# EAGLE design PGTNX07_gate_out (EAGLE 8.5.2)
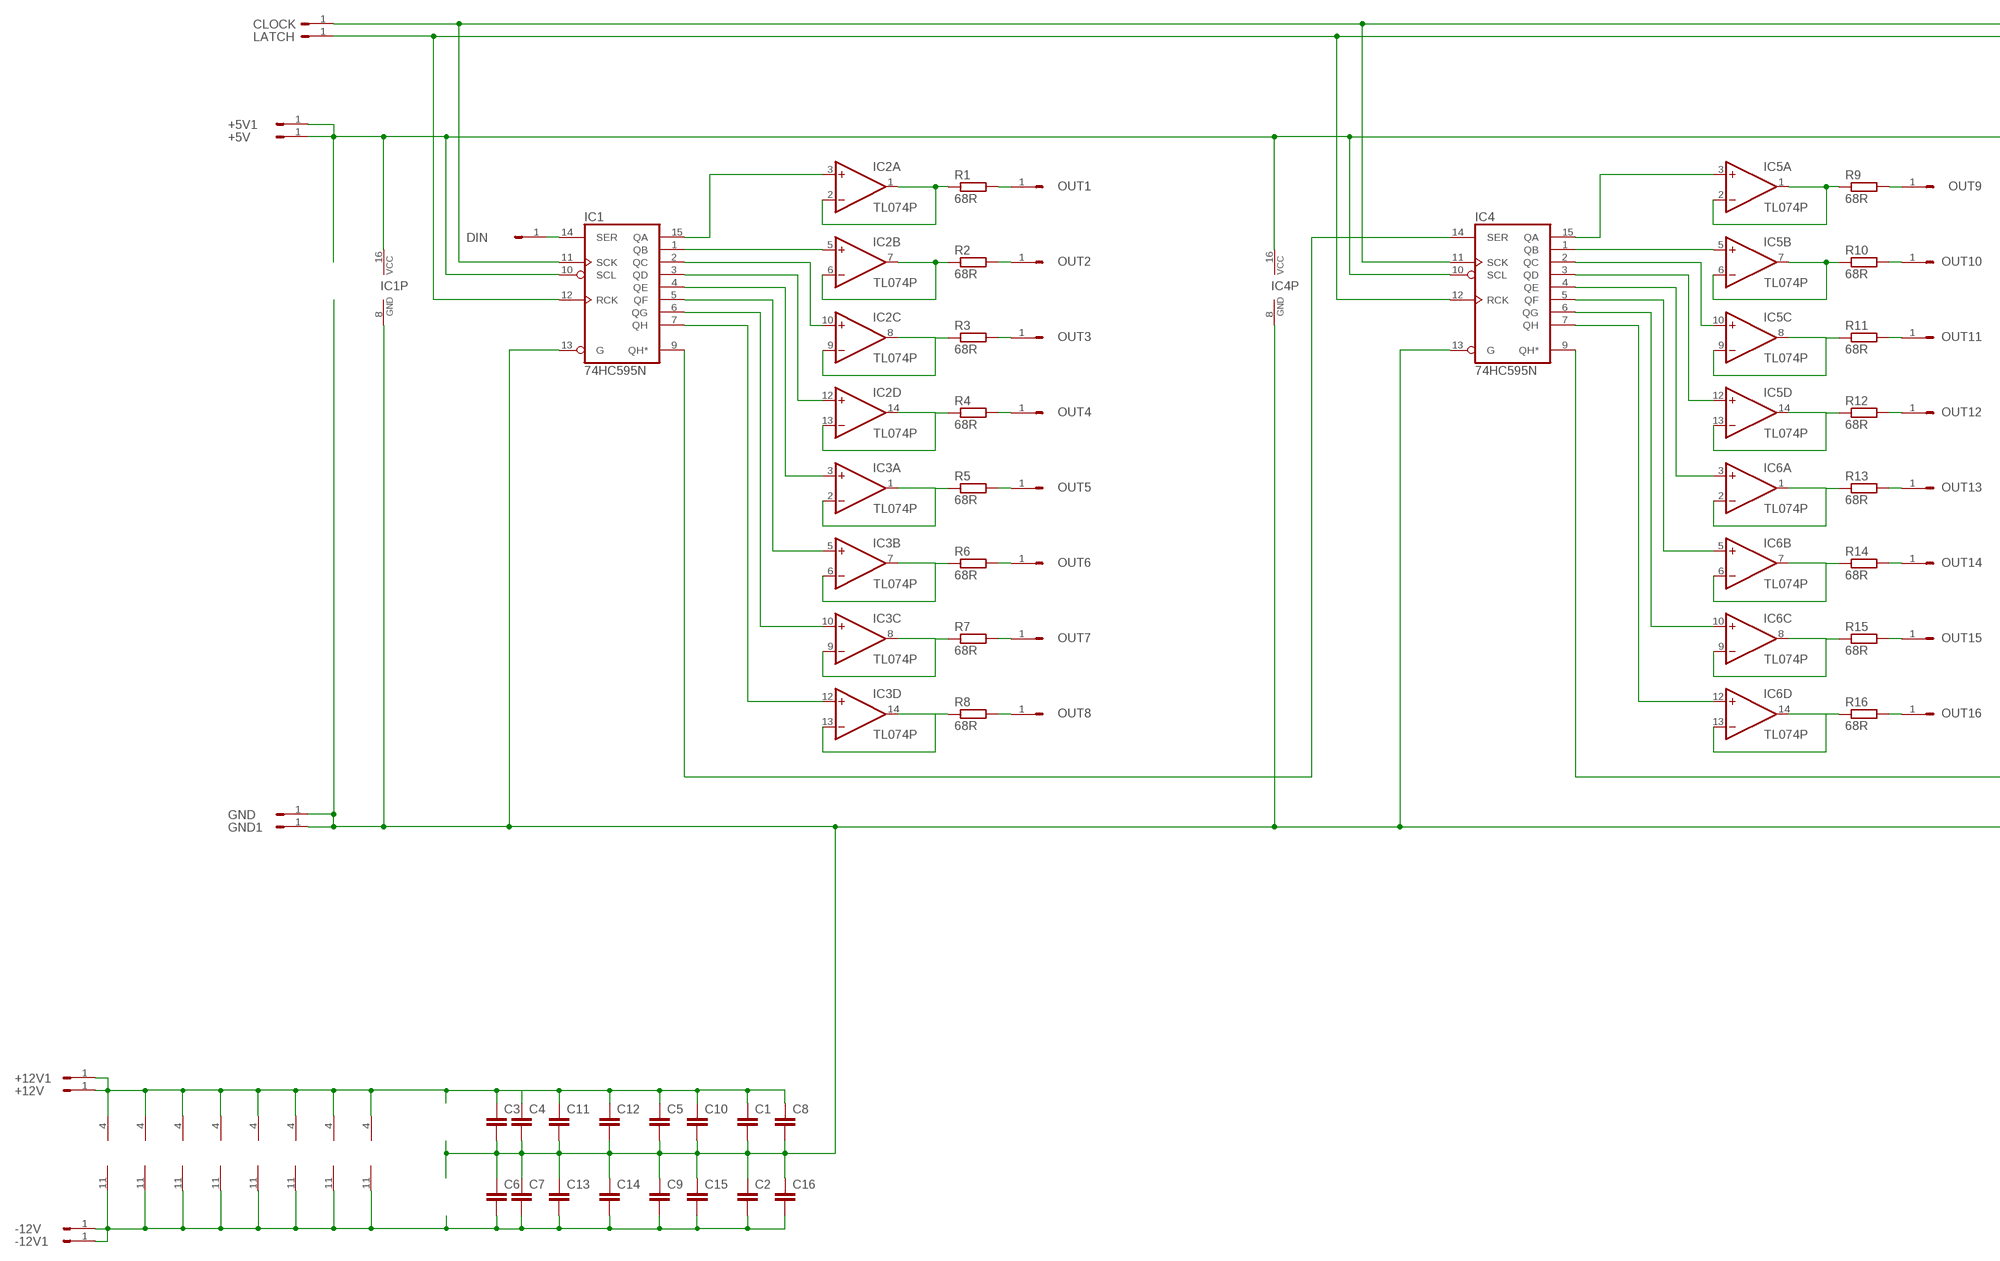
[diagram p0: schematic, sheet 1, part 1 of 2]
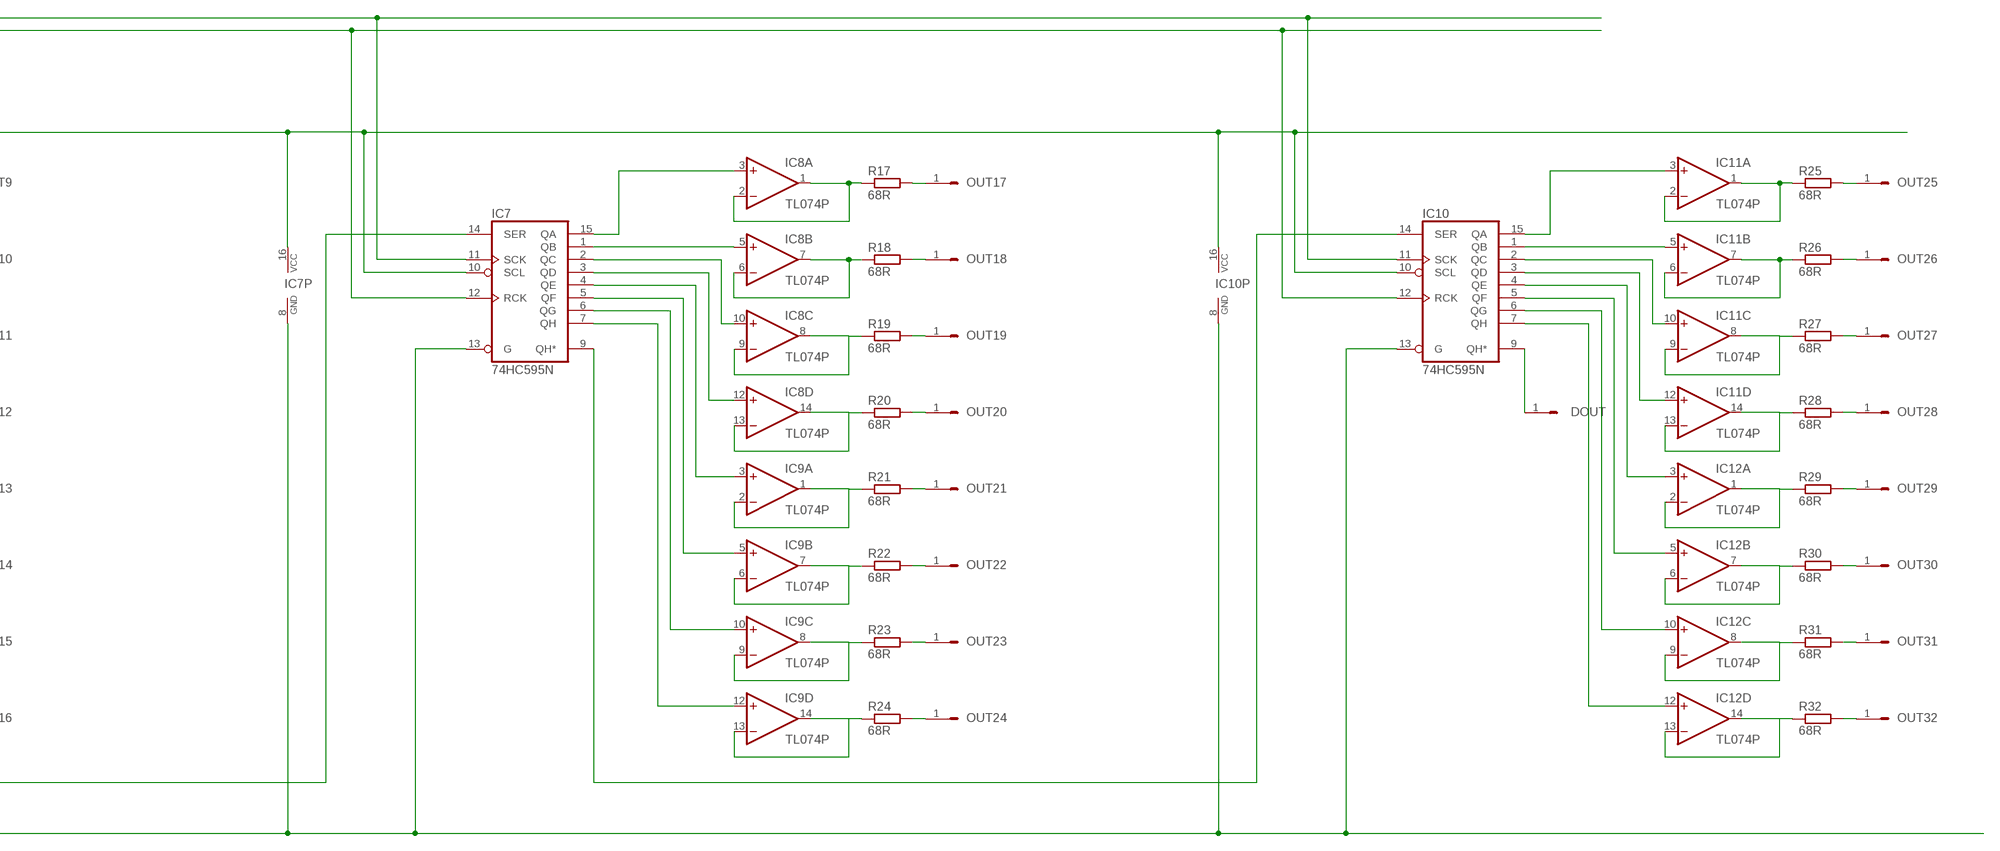
[diagram p1: schematic, sheet 1, part 2 of 2]

## Parts
+5V  HEADER/MALE/01  [HEADER/MALE/01]
+5V1  HEADER/MALE/01  [HEADER/MALE/01]
+12V  HEADER/MALE/01  [HEADER/MALE/01]
+12V1  HEADER/MALE/01  [HEADER/MALE/01]
-12V  HEADER/MALE/01  [HEADER/MALE/01]
-12V1  HEADER/MALE/01  [HEADER/MALE/01]
C1  CAPACITORCERAMICDISC/5  [CERAMICDISC/5]
C2  CAPACITORCERAMICDISC/5  [CERAMICDISC/5]
C3  CAPACITORCERAMICDISC/5  [CERAMICDISC/5]
C4  CAPACITORCERAMICDISC/5  [CERAMICDISC/5]
C5  CAPACITORCERAMICDISC/5  [CERAMICDISC/5]
C6  CAPACITORCERAMICDISC/5  [CERAMICDISC/5]
C7  CAPACITORCERAMICDISC/5  [CERAMICDISC/5]
C8  CAPACITORCERAMICDISC/5  [CERAMICDISC/5]
C9  CAPACITORCERAMICDISC/5  [CERAMICDISC/5]
C10  CAPACITORCERAMICDISC/5  [CERAMICDISC/5]
C11  CAPACITORCERAMICDISC/5  [CERAMICDISC/5]
C12  CAPACITORCERAMICDISC/5  [CERAMICDISC/5]
C13  CAPACITORCERAMICDISC/5  [CERAMICDISC/5]
C14  CAPACITORCERAMICDISC/5  [CERAMICDISC/5]
C15  CAPACITORCERAMICDISC/5  [CERAMICDISC/5]
C16  CAPACITORCERAMICDISC/5  [CERAMICDISC/5]
CLOCK  HEADER/MALE/01  [HEADER/MALE/01]
DIN  HEADER/MALE/01  [HEADER/MALE/01]
DOUT  HEADER/MALE/01  [HEADER/MALE/01]
GND  HEADER/MALE/01  [HEADER/MALE/01]
GND1  HEADER/MALE/01  [HEADER/MALE/01]
IC1  74HC595N  [DIL16]
IC2  TL074P  [DIL14]
IC3  TL074P  [DIL14]
IC4  74HC595N  [DIL16]
IC5  TL074P  [DIL14]
IC6  TL074P  [DIL14]
IC7  74HC595N  [DIL16]
IC8  TL074P  [DIL14]
IC9  TL074P  [DIL14]
IC10  74HC595N  [DIL16]
IC11  TL074P  [DIL14]
IC12  TL074P  [DIL14]
LATCH  HEADER/MALE/01  [HEADER/MALE/01]
OUT1  HEADER/MALE/01  [HEADER/MALE/01]
OUT2  HEADER/MALE/01  [HEADER/MALE/01]
OUT3  HEADER/MALE/01  [HEADER/MALE/01]
OUT4  HEADER/MALE/01  [HEADER/MALE/01]
OUT5  HEADER/MALE/01  [HEADER/MALE/01]
OUT6  HEADER/MALE/01  [HEADER/MALE/01]
OUT7  HEADER/MALE/01  [HEADER/MALE/01]
OUT8  HEADER/MALE/01  [HEADER/MALE/01]
OUT9  HEADER/MALE/01  [HEADER/MALE/01]
OUT10  HEADER/MALE/01  [HEADER/MALE/01]
OUT11  HEADER/MALE/01  [HEADER/MALE/01]
OUT12  HEADER/MALE/01  [HEADER/MALE/01]
OUT13  HEADER/MALE/01  [HEADER/MALE/01]
OUT14  HEADER/MALE/01  [HEADER/MALE/01]
OUT15  HEADER/MALE/01  [HEADER/MALE/01]
OUT16  HEADER/MALE/01  [HEADER/MALE/01]
OUT17  HEADER/MALE/01  [HEADER/MALE/01]
OUT18  HEADER/MALE/01  [HEADER/MALE/01]
OUT19  HEADER/MALE/01  [HEADER/MALE/01]
OUT20  HEADER/MALE/01  [HEADER/MALE/01]
OUT21  HEADER/MALE/01  [HEADER/MALE/01]
OUT22  HEADER/MALE/01  [HEADER/MALE/01]
OUT23  HEADER/MALE/01  [HEADER/MALE/01]
OUT24  HEADER/MALE/01  [HEADER/MALE/01]
OUT25  HEADER/MALE/01  [HEADER/MALE/01]
OUT26  HEADER/MALE/01  [HEADER/MALE/01]
OUT27  HEADER/MALE/01  [HEADER/MALE/01]
OUT28  HEADER/MALE/01  [HEADER/MALE/01]
OUT29  HEADER/MALE/01  [HEADER/MALE/01]
OUT30  HEADER/MALE/01  [HEADER/MALE/01]
OUT31  HEADER/MALE/01  [HEADER/MALE/01]
OUT32  HEADER/MALE/01  [HEADER/MALE/01]
R1  68R  RESISTORRESISTOR/UPRIGHT/7.5  [RESISTOR/7.5]
R2  68R  RESISTORRESISTOR/UPRIGHT/7.5  [RESISTOR/7.5]
R3  68R  RESISTORRESISTOR/UPRIGHT/7.5  [RESISTOR/7.5]
R4  68R  RESISTORRESISTOR/UPRIGHT/7.5  [RESISTOR/7.5]
R5  68R  RESISTORRESISTOR/UPRIGHT/7.5  [RESISTOR/7.5]
R6  68R  RESISTORRESISTOR/UPRIGHT/7.5  [RESISTOR/7.5]
R7  68R  RESISTORRESISTOR/UPRIGHT/7.5  [RESISTOR/7.5]
R8  68R  RESISTORRESISTOR/UPRIGHT/7.5  [RESISTOR/7.5]
R9  68R  RESISTORRESISTOR/UPRIGHT/7.5  [RESISTOR/7.5]
R10  68R  RESISTORRESISTOR/UPRIGHT/7.5  [RESISTOR/7.5]
R11  68R  RESISTORRESISTOR/UPRIGHT/7.5  [RESISTOR/7.5]
R12  68R  RESISTORRESISTOR/UPRIGHT/7.5  [RESISTOR/7.5]
R13  68R  RESISTORRESISTOR/UPRIGHT/7.5  [RESISTOR/7.5]
R14  68R  RESISTORRESISTOR/UPRIGHT/7.5  [RESISTOR/7.5]
R15  68R  RESISTORRESISTOR/UPRIGHT/7.5  [RESISTOR/7.5]
R16  68R  RESISTORRESISTOR/UPRIGHT/7.5  [RESISTOR/7.5]
R17  68R  RESISTORRESISTOR/UPRIGHT/7.5  [RESISTOR/7.5]
R18  68R  RESISTORRESISTOR/UPRIGHT/7.5  [RESISTOR/7.5]
R19  68R  RESISTORRESISTOR/UPRIGHT/7.5  [RESISTOR/7.5]
R20  68R  RESISTORRESISTOR/UPRIGHT/7.5  [RESISTOR/7.5]
R21  68R  RESISTORRESISTOR/UPRIGHT/7.5  [RESISTOR/7.5]
R22  68R  RESISTORRESISTOR/UPRIGHT/7.5  [RESISTOR/7.5]
R23  68R  RESISTORRESISTOR/UPRIGHT/7.5  [RESISTOR/7.5]
R24  68R  RESISTORRESISTOR/UPRIGHT/7.5  [RESISTOR/7.5]
R25  68R  RESISTORRESISTOR/UPRIGHT/7.5  [RESISTOR/7.5]
R26  68R  RESISTORRESISTOR/UPRIGHT/7.5  [RESISTOR/7.5]
R27  68R  RESISTORRESISTOR/UPRIGHT/7.5  [RESISTOR/7.5]
R28  68R  RESISTORRESISTOR/UPRIGHT/7.5  [RESISTOR/7.5]
R29  68R  RESISTORRESISTOR/UPRIGHT/7.5  [RESISTOR/7.5]
R30  68R  RESISTORRESISTOR/UPRIGHT/7.5  [RESISTOR/7.5]
R31  68R  RESISTORRESISTOR/UPRIGHT/7.5  [RESISTOR/7.5]
R32  68R  RESISTORRESISTOR/UPRIGHT/7.5  [RESISTOR/7.5]

## Nets
CLK2: +5V1.1 +5V.1 IC1.10(SCL) IC1.16(VCC) IC4.10(SCL) IC4.16(VCC) IC7.10(SCL) IC7.16(VCC) IC10.10(SCL) IC10.16(VCC)
GND: C1.2 C2.1 C3.2 C4.2 C5.2 C6.1 C7.1 C8.2 C9.1 C10.2 C11.2 C12.2 C13.1 C14.1 C15.1 C16.1 GND1.1 GND.1 IC1.8(GND) IC1.13(G) IC4.8(GND) IC4.13(G) IC7.8(GND) IC7.13(G) IC10.8(GND) IC10.13(G)
N$1: IC1.15(QA) IC2.3(A:+IN)
N$2: IC1.1(QB) IC2.5(B:+IN)
N$4: DIN.1 IC1.14(SER)
N$6: IC1.2(QC) IC2.10(C:+IN)
N$7: IC1.3(QD) IC2.12(D:+IN)
N$8: IC1.4(QE) IC3.3(A:+IN)
N$9: IC1.5(QF) IC3.5(B:+IN)
N$10: IC1.6(QG) IC3.10(C:+IN)
N$11: IC1.7(QH) IC3.12(D:+IN)
N$12: IC1.9(QH*) IC4.14(SER)
N$13: IC2.1(A:OUT) IC2.2(A:-IN) R1.1
N$14: OUT1.1 R1.2
N$15: IC2.6(B:-IN) IC2.7(B:OUT) R2.1
N$16: OUT2.1 R2.2
N$17: +12V1.1 +12V.1 C1.1 C3.1 C4.1 C5.1 C8.1 C10.1 C11.1 C12.1 IC2.4(P:V+) IC3.4(P:V+) IC5.4(P:V+) IC6.4(P:V+) IC8.4(P:V+) IC9.4(P:V+) IC11.4(P:V+) IC12.4(P:V+)
N$18: -12V1.1 -12V.1 C2.2 C6.2 C7.2 C9.2 C13.2 C14.2 C15.2 C16.2 IC2.11(P:V-) IC3.11(P:V-) IC5.11(P:V-) IC6.11(P:V-) IC8.11(P:V-) IC9.11(P:V-) IC11.11(P:V-) IC12.11(P:V-)
N$19: CLOCK.1 IC1.11(SCK) IC4.11(SCK) IC7.11(SCK) IC10.11(SCK)
N$21: IC2.8(C:OUT) IC2.9(C:-IN) R3.1
N$22: IC2.13(D:-IN) IC2.14(D:OUT) R4.1
N$23: IC3.1(A:OUT) IC3.2(A:-IN) R5.1
N$24: IC3.6(B:-IN) IC3.7(B:OUT) R6.1
N$25: IC3.8(C:OUT) IC3.9(C:-IN) R7.1
N$26: IC3.13(D:-IN) IC3.14(D:OUT) R8.1
N$27: OUT3.1 R3.2
N$28: OUT4.1 R4.2
N$29: OUT5.1 R5.2
N$30: OUT6.1 R6.2
N$31: OUT7.1 R7.2
N$32: OUT8.1 R8.2
N$33: IC1.12(RCK) IC4.12(RCK) IC7.12(RCK) IC10.12(RCK) LATCH.1
N$34: IC4.9(QH*) IC7.14(SER)
N$35: IC4.2(QC) IC5.10(C:+IN)
N$36: IC4.3(QD) IC5.12(D:+IN)
N$37: IC4.4(QE) IC6.3(A:+IN)
N$38: IC4.5(QF) IC6.5(B:+IN)
N$39: IC4.6(QG) IC6.10(C:+IN)
N$40: IC4.15(QA) IC5.3(A:+IN)
N$41: IC4.1(QB) IC5.5(B:+IN)
N$42: IC4.7(QH) IC6.12(D:+IN)
N$43: IC5.1(A:OUT) IC5.2(A:-IN) R9.1
N$44: OUT9.1 R9.2
N$45: IC5.6(B:-IN) IC5.7(B:OUT) R10.1
N$46: OUT10.1 R10.2
N$47: IC7.9(QH*) IC10.14(SER)
N$48: IC7.2(QC) IC8.10(C:+IN)
N$49: IC5.8(C:OUT) IC5.9(C:-IN) R11.1
N$50: IC5.13(D:-IN) IC5.14(D:OUT) R12.1
N$51: IC6.1(A:OUT) IC6.2(A:-IN) R13.1
N$52: IC6.6(B:-IN) IC6.7(B:OUT) R14.1
N$53: IC6.8(C:OUT) IC6.9(C:-IN) R15.1
N$54: IC6.13(D:-IN) IC6.14(D:OUT) R16.1
N$55: OUT11.1 R11.2
N$56: OUT12.1 R12.2
N$57: OUT13.1 R13.2
N$58: OUT14.1 R14.2
N$59: OUT15.1 R15.2
N$60: OUT16.1 R16.2
N$61: IC7.3(QD) IC8.12(D:+IN)
N$62: IC7.4(QE) IC9.3(A:+IN)
N$63: IC7.5(QF) IC9.5(B:+IN)
N$64: IC7.6(QG) IC9.10(C:+IN)
N$65: IC7.15(QA) IC8.3(A:+IN)
N$66: IC7.1(QB) IC8.5(B:+IN)
N$67: IC7.7(QH) IC9.12(D:+IN)
N$68: IC8.1(A:OUT) IC8.2(A:-IN) R17.1
N$69: OUT17.1 R17.2
N$70: IC8.6(B:-IN) IC8.7(B:OUT) R18.1
N$71: OUT18.1 R18.2
N$72: IC8.8(C:OUT) IC8.9(C:-IN) R19.1
N$73: IC8.13(D:-IN) IC8.14(D:OUT) R20.1
N$74: IC9.1(A:OUT) IC9.2(A:-IN) R21.1
N$75: IC9.6(B:-IN) IC9.7(B:OUT) R22.1
N$76: IC9.8(C:OUT) IC9.9(C:-IN) R23.1
N$77: IC9.13(D:-IN) IC9.14(D:OUT) R24.1
N$78: OUT19.1 R19.2
N$79: OUT20.1 R20.2
N$80: OUT21.1 R21.2
N$81: OUT22.1 R22.2
N$82: OUT23.1 R23.2
N$83: OUT24.1 R24.2
N$84: DOUT.1 IC10.9(QH*)
N$85: IC10.2(QC) IC11.10(C:+IN)
N$86: IC10.3(QD) IC11.12(D:+IN)
N$87: IC10.4(QE) IC12.3(A:+IN)
N$88: IC10.5(QF) IC12.5(B:+IN)
N$89: IC10.6(QG) IC12.10(C:+IN)
N$90: IC10.15(QA) IC11.3(A:+IN)
N$91: IC10.1(QB) IC11.5(B:+IN)
N$92: IC10.7(QH) IC12.12(D:+IN)
N$93: IC11.1(A:OUT) IC11.2(A:-IN) R25.1
N$94: OUT25.1 R25.2
N$95: IC11.6(B:-IN) IC11.7(B:OUT) R26.1
N$96: OUT26.1 R26.2
N$97: IC11.8(C:OUT) IC11.9(C:-IN) R27.1
N$98: IC11.13(D:-IN) IC11.14(D:OUT) R28.1
N$99: IC12.1(A:OUT) IC12.2(A:-IN) R29.1
N$100: IC12.6(B:-IN) IC12.7(B:OUT) R30.1
N$101: IC12.8(C:OUT) IC12.9(C:-IN) R31.1
N$102: IC12.13(D:-IN) IC12.14(D:OUT) R32.1
N$103: OUT27.1 R27.2
N$104: OUT28.1 R28.2
N$105: OUT29.1 R29.2
N$106: OUT30.1 R30.2
N$107: OUT31.1 R31.2
N$108: OUT32.1 R32.2

## Library data of the parts
+5V +5V1 +12V +12V1 -12V -12V1 CLOCK DIN DOUT GND GND1 LATCH OUT1-OUT32 = connectors:HEADER/MALE/01
C1-C16 = capacitors:CAPACITOR: CAPACITOR, European symbol
IC1 IC4 IC7 IC10 = ic_digital:74*595: 8-bit SHIFT REGISTER, output latch
IC2 IC3 IC5 IC6 IC8 IC9 IC11 IC12 = ic_analogue:TL074: OP AMP
R1-R32 = resistors:RESISTOR: RESISTOR, European symbol

## Board
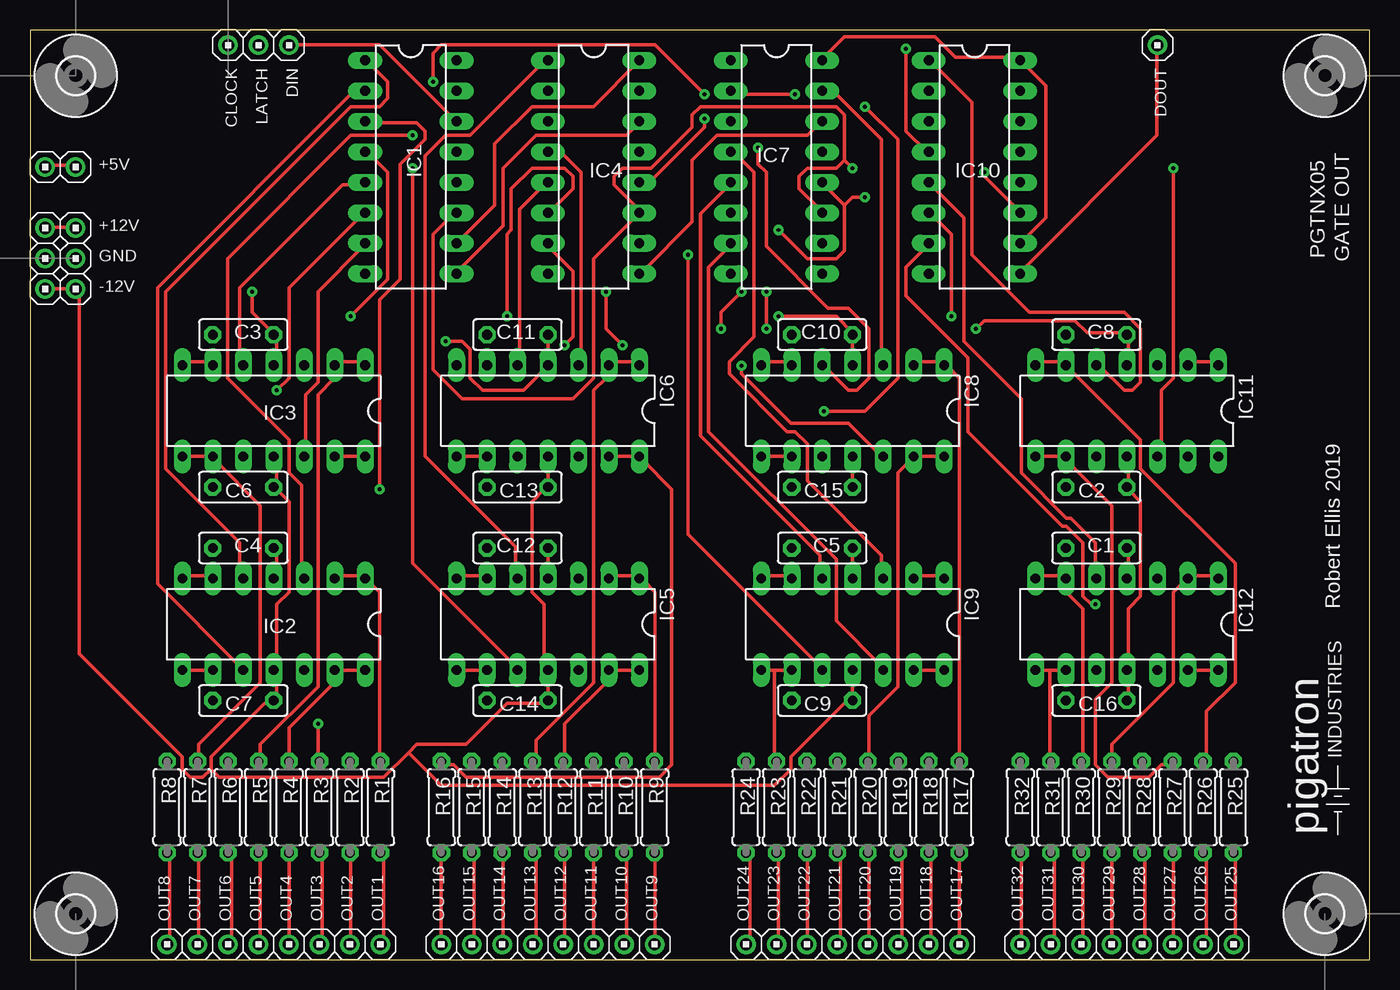
[diagram p2: board, top side]
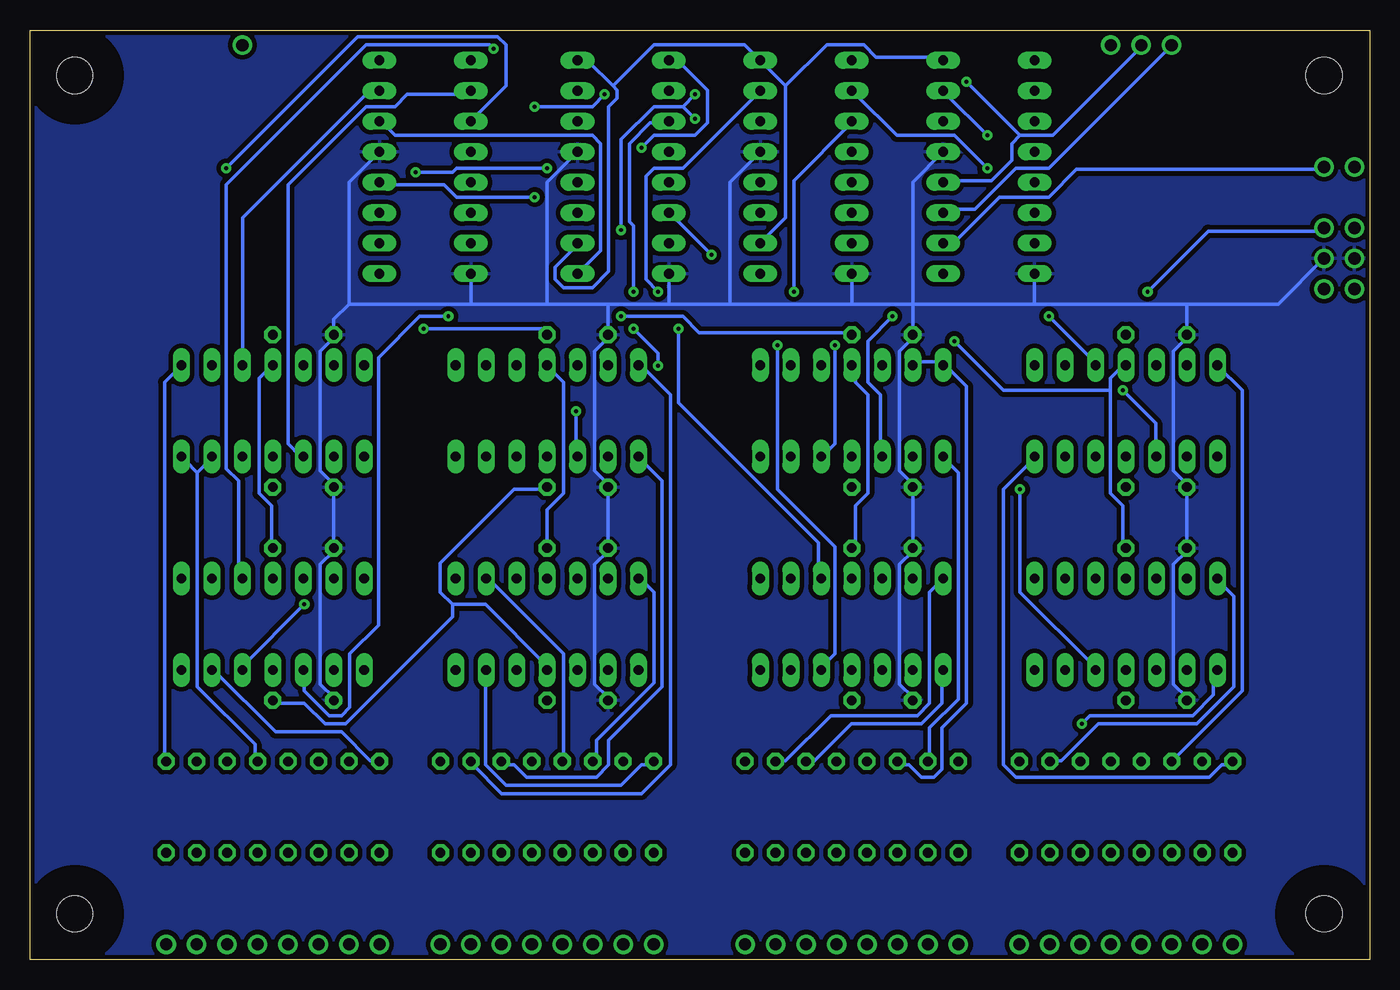
[diagram p3: board, bottom side, seen from below]

Size 111.68 x 77.46 mm. Coordinates in mm from the lower left corner, seen from the top.
Outline: 0,0 111.68,0 111.68,77.46 0,77.46 0,0
Copper layers (1*16): Top 0.0356mm / dielectric 1.5011mm / Bottom 0.0356mm
Design rules "pigatron": minimum track width 12mil, minimum drill 13mil, track to track 15mil, track to pad 10mil, pad to pad 10mil, via to via 10mil, smd to smd 6mil, copper to edge 15mil, drill to drill 10mil, minimum pad ring 12mil, minimum via ring 10mil, stop-mask expansion 4mil, vias tented up to drill 0mil, thermal gap 10mil

### Footprints (pad centres in the part's own frame; a part is rotated, then mirrored left to right if it is on the bottom)
HEADER/MALE/01 = drill 1.016: 1 0,0
CERAMICDISC/5 = drill 0.813 octagon: 1 -2.54,0; 2 2.54,0
DIL16 = drill 0.813 long: 1 -8.89,-3.81; 2 -6.35,-3.81; 3 -3.81,-3.81; 4 -1.27,-3.81; 5 1.27,-3.81; 6 3.81,-3.81; 7 6.35,-3.81; 8 8.89,-3.81; 9 8.89,3.81; 10 6.35,3.81; 11 3.81,3.81; 12 1.27,3.81; 13 -1.27,3.81; 14 -3.81,3.81; 15 -6.35,3.81; 16 -8.89,3.81
DIL14 = drill 0.813 long: 1 -7.62,-3.81; 2 -5.08,-3.81; 3 -2.54,-3.81; 4 0,-3.81; 5 2.54,-3.81; 6 5.08,-3.81; 7 7.62,-3.81; 8 7.62,3.81; 9 5.08,3.81; 10 2.54,3.81; 11 0,3.81; 12 -2.54,3.81; 13 -5.08,3.81; 14 -7.62,3.81
RESISTOR/7.5 = drill 0.813 octagon: 1 -3.81,0; 2 3.81,0
STANDOFF/3.0 = hole 3: 0,0

### Placement (x,y rotation side)
+5V  3.81,66.04 0 top
+5V1  1.27,66.04 0 top
+12V  3.81,60.96 0 top
+12V1  1.27,60.96 0 top
-12V  3.81,55.88 0 top
-12V1  1.27,55.88 0 top
C1  88.9,34.29 180 top
C2  88.9,39.37 0 top
C3  17.78,52.07 180 top
C4  17.78,34.29 180 top
C5  66.04,34.29 180 top
C6  17.78,39.37 0 top
C7  17.78,21.59 0 top
C8  88.9,52.07 180 top
C9  66.04,21.59 0 top
C10  66.04,52.07 180 top
C11  40.64,52.07 180 top
C12  40.64,34.29 180 top
C13  40.64,39.37 0 top
C14  40.64,21.59 0 top
C15  66.04,39.37 0 top
C16  88.9,21.59 0 top
CLOCK  16.51,76.2 270 top
DIN  21.59,76.2 270 top
DOUT  93.98,76.2 270 top
GND  3.81,58.42 0 top
GND1  1.27,58.42 0 top
IC1  31.75,66.04 270 top
IC2  20.32,27.94 180 top
IC3  20.32,45.72 180 top
IC4  46.99,66.04 270 top
IC5  43.18,27.94 180 top
IC6  43.18,45.72 180 top
IC7  62.23,66.04 270 top
IC8  68.58,45.72 180 top
IC9  68.58,27.94 180 top
IC10  78.74,66.04 270 top
IC11  91.44,45.72 180 top
IC12  91.44,27.94 180 top
LATCH  19.05,76.2 270 top
OUT1  29.21,1.27 90 top
OUT2  26.67,1.27 90 top
OUT3  24.13,1.27 90 top
OUT4  21.59,1.27 90 top
OUT5  19.05,1.27 90 top
OUT6  16.51,1.27 90 top
OUT7  13.97,1.27 90 top
OUT8  11.43,1.27 90 top
OUT9  52.07,1.27 90 top
OUT10  49.53,1.27 90 top
OUT11  46.99,1.27 90 top
OUT12  44.45,1.27 90 top
OUT13  41.91,1.27 90 top
OUT14  39.37,1.27 90 top
OUT15  36.83,1.27 90 top
OUT16  34.29,1.27 90 top
OUT17  77.47,1.27 90 top
OUT18  74.93,1.27 90 top
OUT19  72.39,1.27 90 top
OUT20  69.85,1.27 90 top
OUT21  67.31,1.27 90 top
OUT22  64.77,1.27 90 top
OUT23  62.23,1.27 90 top
OUT24  59.69,1.27 90 top
OUT25  100.33,1.27 90 top
OUT26  97.79,1.27 90 top
OUT27  95.25,1.27 90 top
OUT28  92.71,1.27 90 top
OUT29  90.17,1.27 90 top
OUT30  87.63,1.27 90 top
OUT31  85.09,1.27 90 top
OUT32  82.55,1.27 90 top
R1  29.21,12.7 270 top
R2  26.67,12.7 270 top
R3  24.13,12.7 270 top
R4  21.59,12.7 270 top
R5  19.05,12.7 270 top
R6  16.51,12.7 270 top
R7  13.97,12.7 270 top
R8  11.43,12.7 270 top
R9  52.07,12.7 270 top
R10  49.53,12.7 270 top
R11  46.99,12.7 270 top
R12  44.45,12.7 270 top
R13  41.91,12.7 270 top
R14  39.37,12.7 270 top
R15  36.83,12.7 270 top
R16  34.29,12.7 270 top
R17  77.47,12.7 270 top
R18  74.93,12.7 270 top
R19  72.39,12.7 270 top
R20  69.85,12.7 270 top
R21  67.31,12.7 270 top
R22  64.77,12.7 270 top
R23  62.23,12.7 270 top
R24  59.69,12.7 270 top
R25  100.33,12.7 270 top
R26  97.79,12.7 270 top
R27  95.25,12.7 270 top
R28  92.71,12.7 270 top
R29  90.17,12.7 270 top
R30  87.63,12.7 270 top
R31  85.09,12.7 270 top
R32  82.55,12.7 270 top
U$1  [STANDOFF/3.0]  107.95,73.66 0 top
U$2  [STANDOFF/3.0]  107.95,3.81 0 top
U$3  [STANDOFF/3.0]  3.81,73.66 0 top
U$4  [STANDOFF/3.0]  3.81,3.81 0 top
U$5  [PIGATRON-LOGO]  107.44,19.3 90 top

### Tracks (layer width: path | path; a pad name or v marks a point on that pad's centre or on a via)
CLK2
  Top 0.305: IC10.10 82.64,59.77 84.7,61.82 84.7,72.8 82.64,74.85 IC10.16 82.3,75.2 77.15,75.2 75.44,76.91 67.89,76.91 66.18,75.2 IC7.16 | +5V1.1 1.37,66.18 3.77,66.18 +5V.1 | IC1.10 35.66,59.77 38.75,62.85 38.75,68 41.83,71.08 46.98,71.08 50.75,74.85 IC4.16
  Bottom 0.305: 63.09,72.8 65.15,74.85 65.84,74.85 IC7.16 | 63.09,72.8 62.75,72.45 62.75,71.77 63.44,71.08 63.44,57.37 64.81,55.99 67.21,55.99 67.89,56.68 67.89,57.71 66.18,59.42 IC7.10 | 48.69,72.8 48.69,61.82 50.75,59.77 IC4.10 | 48.69,72.8 50.75,74.85 IC4.16 51.09,75.2 52.12,76.23 59.66,76.23 63.09,72.8 | 48.69,72.8 45.26,76.23 42.18,76.23 41.15,75.2 35.66,75.2 IC1.16 | +5V.1 4.12,65.84 24.45,65.84 26.75,63.54 30.86,63.54 34.63,59.77 35.32,59.77 IC1.10
GND
  Top 0.305: 1.37,58.64 GND1.1 | 3.77,58.64 GND.1
  Bottom 0.305: GND.1 7.62,54.61 15.24,54.61 | 15.24,54.61 27.94,54.61 | 27.94,54.61 38.1,54.61 | 38.1,54.61 43.18,54.61 | 43.18,54.61 53.34,54.61 | 53.34,54.61 58.42,54.61 | 58.42,54.61 63.5,54.61 | 63.5,54.61 68.58,54.61 | 68.58,54.61 74.93,54.61 | 74.93,54.61 85.09,54.61 | 85.09,54.61 86.36,53.34 C8.2 86.36,51.82 87.48,50.7 87.48,40.74 86.36,39.62 C2.1 C1.2 86.36,34.04 87.48,32.92 87.48,22.96 86.36,21.84 C16.1 | 15.24,54.61 C3.2 15.24,51.82 16.36,50.7 16.36,40.74 15.24,39.62 C6.1 C4.2 15.24,34.04 16.36,32.92 16.36,22.96 15.24,21.84 C7.1 | 38.1,54.61 C11.2 38.1,51.82 39.22,50.7 39.22,40.74 38.1,39.62 C13.1 C12.2 38.1,34.04 39.22,32.92 39.22,22.96 38.1,21.84 C14.1 | 63.5,54.61 C10.2 63.5,51.82 64.62,50.7 64.62,40.74 63.5,39.62 C15.1 C5.2 63.5,34.04 64.62,32.92 64.62,22.96 63.5,21.84 C9.1 | IC1.8 27.94,54.61 | IC4.8 43.18,54.61 | IC7.8 58.42,54.61 | IC10.8 74.93,54.61 | IC1.13 38.1,64.77 38.1,54.61 | IC4.13 53.34,64.77 53.34,54.61 | IC7.13 68.58,64.77 68.58,54.61 | IC10.13 85.09,64.77 85.09,54.61
  pour Bottom: 0,77.47 0,0 111.76,0 111.76,77.47
N$1  (via drill 0.33)
  Top 0.305: v31.89,68.68 26.75,68.68 16.46,58.39 16.46,48.45 21.6,43.31 21.6,40.56 22.63,39.53 22.63,31.99 IC2.3
  Bottom 0.305: v31.89,68.68 35.32,72.11 IC1.15
N$2
  Top 0.305: IC2.5 17.49,31.99 17.49,34.73 11.32,40.91 11.32,55.65 26.75,71.08 29.15,71.08 29.83,71.77 29.83,73.14 28.12,74.85 IC1.1
N$4
  Top 0.305: IC1.14 35.32,70.05 29.15,76.23 21.6,76.23 DIN.1
N$6
  Top 0.305: IC2.10 17.49,24.45 10.63,31.31 10.63,55.99 26.75,72.11 27.77,72.11 IC1.2
N$7  (via drill 0.33)
  Top 0.305: v29.15,39.19 29.15,54.97 30.86,56.68 30.86,66.28 32.92,68.34 32.92,69.02 32.23,69.71 28.12,69.71 IC1.3
  Bottom 0.305: v29.15,39.19 29.15,30.62 22.97,24.45 IC2.12
N$8  (via drill 0.33)
  Top 0.305: v26.75,53.59 29.83,56.68 29.83,65.59 28.12,67.31 IC1.4
  Bottom 0.305: v26.75,53.59 22.97,49.82 IC3.3
N$9
  Top 0.305: IC3.5 17.49,49.82 17.49,55.99 26.06,64.57 27.77,64.57 IC1.5
N$10  (via drill 0.33)
  Top 0.305: v20.57,47.42 21.6,48.45 21.6,55.99 27.77,62.17 IC1.6
  Bottom 0.305: v20.57,47.42 17.83,44.68 17.83,41.93 IC3.10
N$11
  Top 0.305: IC3.12 22.97,41.93 22.97,47.08 24,48.11 24,55.65 27.77,59.42 IC1.7
N$12
  Top 0.305: IC1.9 35.66,57.37 39.43,61.14 39.43,65.94 42.18,68.68 49.72,68.68 50.75,69.71 IC4.14
N$13
  Top 0.305: IC2.2 25.72,31.99 27.77,31.99 IC2.1 28.12,31.65 29.15,30.62 29.15,16.56 R1.1
N$14
  Top 0.305: R1.2 29.49,8.67 29.49,1.47 OUT1.1
N$15
  Top 0.305: IC2.7 13.03,31.99 15.09,31.99 IC2.6
  Bottom 0.305: R2.1 26.4,16.56 25.72,16.56 22.63,19.65 14.4,19.65 11.32,22.73 11.32,30.28 12.69,31.65 IC2.7
N$16
  Top 0.305: R2.2 26.75,8.67 26.75,1.47 OUT2.1
N$17  (via drill 0.33)
  Top 0.305: +12V1.1 1.37,61.04 3.77,61.04 +12V.1 | IC2.4 20.57,31.99 20.57,34.05 C4.1 | IC3.4 20.57,49.82 20.57,51.88 C3.1 20.23,52.22 18.52,53.94 v18.52,55.65 | IC12.4 91.55,31.99 91.55,34.05 C1.1 | IC11.4 91.55,49.82 91.55,51.88 C8.1 91.21,52.22 88.12,52.22 87.1,53.25 79.55,53.25 v78.87,52.56 | IC5.4 43.2,31.99 43.2,34.05 C12.1 | C11.1 43.2,51.88 43.2,49.82 IC6.4 43.2,49.48 41.15,47.42 37.72,47.42 36.69,48.45 36.69,50.85 36.01,51.54 v34.63,51.54 | C5.1 IC9.4 | IC8.4 C10.1 68.58,52.22 67.21,53.59 v62.41,53.59
  Bottom 0.305: 21.6,47.42 21.6,48.45 20.57,49.48 IC3.4 | 21.6,47.42 21.6,38.85 20.57,37.82 20.57,34.39 C4.1 | v18.52,55.65 13.47,60.69 4.12,60.69 +12V.1 | C1.1 91.55,34.39 91.55,37.82 92.58,38.85 92.58,48.45 91.55,49.48 IC11.4 | C12.1 42.86,34.39 42.86,37.82 41.83,38.85 41.83,47.08 42.86,48.11 42.86,49.48 IC6.4 | C5.1 68.58,37.48 67.21,38.85 67.21,48.11 68.58,49.48 IC8.4 | v62.41,53.59 57.26,53.59 55.89,52.22 43.2,52.22 C11.1 | v78.87,52.56 68.92,52.56 68.58,52.22 C10.1 | 21.6,47.42 30.52,47.42 v34.63,51.54
N$18
  Top 0.305: C16.2 91.55,21.7 91.55,24.11 IC12.11 91.55,24.45 91.55,29.25 92.58,30.28 92.58,38.16 91.55,39.19 C2.2 91.55,39.53 91.55,41.59 IC11.11 | IC9.11 C9.2 68.58,21.36 67.89,21.36 63.44,16.9 63.44,15.88 62.06,14.5 34.29,14.5 31.55,17.25 | IC8.11 C15.2 | IC6.11 43.2,41.59 43.2,39.53 C13.2 42.86,39.19 41.83,38.16 41.83,30.62 42.86,29.59 42.86,24.45 IC5.11 43.2,24.11 43.2,21.7 C14.2 42.86,21.36 39.78,21.36 36.35,17.93 32.23,17.93 31.55,17.25 | -12V1.1 1.37,55.89 3.77,55.89 -12V.1 4.12,55.55 4.12,25.48 12.69,16.9 12.69,15.88 13.37,15.19 14.4,15.19 15.09,15.88 | IC3.11 20.57,41.59 20.57,39.53 C6.2 20.57,39.19 21.6,38.16 21.6,30.62 20.57,29.59 20.57,24.45 IC2.11 20.57,24.11 20.57,21.7 C7.2 20.23,21.36 19.55,21.36 15.09,16.9 15.09,15.88 | 31.55,17.25 29.49,15.19 15.77,15.19 15.09,15.88
  Bottom 0.305: 76.47,29.59 73.72,29.59 68.58,24.45 IC9.11 | 76.47,29.59 77.5,30.62 77.5,33.02 71.32,39.19 68.58,39.19 C15.2 | 76.47,29.59 76.47,28.56 85.38,19.65 87.1,19.65 88.81,21.36 91.21,21.36 C16.2
N$19  (via drill 0.33)
  Top 0.305: 67.89,66.62 67.89,70.4 67.21,71.08 55.89,71.08 55.21,70.4 55.21,69.37 51.78,65.94 49.38,65.94 48.69,65.25 48.69,64.57 50.75,62.51 IC4.11 50.75,62.17 46.98,58.39 46.98,48.45 45.26,46.74 36.01,46.74 33.6,49.14 33.6,60.45 35.32,62.17 IC1.11 | 67.89,66.62 67.21,65.94 64.81,65.94 64.12,65.25 64.12,64.22 65.84,62.51 IC7.11 | v79.55,65.59 79.55,65.25 82.3,62.51 IC10.11 | 67.89,66.62 v68.58,65.94
  Bottom 0.305: IC1.11 35.32,62.51 32.92,62.51 29.49,65.94 26.75,65.94 16.8,75.88 CLOCK.1 | v79.55,65.59 76.47,65.59 76.12,65.94 v68.58,65.94
N$21  (via drill 0.33)
  Top 0.305: v24,19.65 24,16.56 R3.1 | IC2.9 15.09,24.11 13.03,24.11 IC2.8
  Bottom 0.305: v24,19.65 23.32,20.33 14.74,20.33 13.03,22.05 13.03,24.11 IC2.8
N$22
  Top 0.305: R4.1 21.6,16.56 21.6,19.3 25.38,23.08 25.38,24.11 IC2.13 25.72,24.11 27.77,24.11 IC2.14
N$23
  Top 0.305: R5.1 19.2,16.56 19.2,17.93 24,22.73 24,47.08 25.38,48.45 25.38,49.48 IC3.2 25.72,49.82 27.77,49.82 IC3.1
N$24
  Top 0.305: IC3.7 13.03,49.82 15.09,49.82 IC3.6
  Bottom 0.305: R6.1 10.63,22.39 10.63,47.42 12.69,49.48 IC3.7
N$25
  Top 0.305: IC3.8 13.03,41.93 15.09,41.93 IC3.9 15.43,41.59 19.2,37.82 19.2,23.08 14.06,17.93 14.06,16.56 R7.1
N$26
  Top 0.305: IC3.13 25.72,41.93 27.77,41.93 IC3.14
  Bottom 0.305: R8.1 11.66,16.22 12.34,16.22 13.37,15.19 29.49,15.19 30.52,16.22 30.52,39.19 28.12,41.59 IC3.14
N$27
  Top 0.305: R3.2 24.35,8.67 24.35,1.47 OUT3.1
N$28
  Top 0.305: R4.2 21.6,8.67 21.6,1.47 OUT4.1
N$29
  Top 0.305: R5.2 19.2,8.67 19.2,1.47 OUT5.1
N$30
  Top 0.305: R6.2 16.8,8.67 16.8,1.47 OUT6.1
N$31
  Top 0.305: R7.2 14.06,8.67 14.06,1.47 OUT7.1
N$32
  Top 0.305: R8.2 11.66,8.67 11.66,1.47 OUT8.1
N$33  (via drill 0.33)
  Top 0.305: v56.24,70.05 56.24,69.37 51.78,64.91 51.09,64.91 IC4.12 | v62.41,60.79 64.81,58.39 67.21,58.39 67.89,59.08 67.89,62.85 | 67.89,62.85 66.18,64.57 IC7.12 | v69.61,63.54 68.58,63.54 67.89,62.85 | v33.6,73.14 33.6,75.54 34.29,76.23 52.12,76.23 v56.24,72.11
  Bottom 0.305: 29.15,68.68 29.83,68 29.83,66.62 31.55,64.91 35.32,64.91 IC1.12 | 29.15,68.68 26.4,68.68 19.2,75.88 LATCH.1 | 57.26,71.08 v56.24,70.05 | 57.26,71.08 59.66,71.08 62.41,68.34 v62.41,60.79 | v69.61,63.54 76.12,63.54 77.15,64.57 82.3,64.57 IC10.12 | v33.6,73.14 29.15,68.68 | 57.26,71.08 v56.24,72.11
N$34
  Top 0.305: IC4.9 51.09,57.37 55.21,61.48 55.21,66.62 57.26,68.68 64.81,68.68 65.84,69.71 IC7.14
N$35  (via drill 0.33)
  Top 0.305: v31.89,65.94 31.89,33.02 40.46,24.45 IC5.10
  Bottom 0.305: v31.89,65.94 34.63,68.68 39.43,68.68 42.86,72.11 IC4.2
N$36  (via drill 0.33)
  Top 0.305: v48.01,55.65 48.01,52.56 v49.38,51.19
  Bottom 0.305: v48.01,55.65 48.01,64.91 43.2,69.71 IC4.3 | v49.38,51.19 49.38,39.19 44.58,34.39 44.58,25.48 45.61,24.45 IC5.12
N$37
  Top 0.305: IC4.4 44.23,67.31 45.95,65.59 45.95,49.82 IC6.3
N$38
  Top 0.305: IC6.5 40.8,49.82 40.8,62.51 42.86,64.57 IC4.5
N$39  (via drill 0.33)
  Top 0.305: v39.78,53.59 39.78,60.45 40.12,60.79 40.12,64.22 41.83,65.94 44.58,65.94 45.26,65.25 45.26,64.22 43.2,62.17 IC4.6
  Bottom 0.305: v39.78,53.59 41.83,51.54 41.83,48.11 40.8,47.08 40.8,41.93 IC6.10
N$40  (via drill 0.33)
  Top 0.305: v57.61,52.56 57.61,53.94 v59.32,55.65
  Bottom 0.305: v57.61,52.56 57.61,46.39 45.95,34.73 45.95,31.99 IC5.3 | v59.32,55.65 60.35,56.68 60.35,65.25 59.66,65.94 57.26,65.94 51.09,72.11 IC4.15
N$41
  Top 0.305: IC5.5 40.46,31.99 40.46,34.39 32.92,41.93 32.92,66.97 34.63,68.68 36.69,68.68 42.86,74.85 IC4.1
N$42  (via drill 0.33)
  Top 0.305: v44.58,51.19 45.26,51.88 45.26,57.37 43.2,59.42 IC4.7
  Bottom 0.305: v44.58,51.19 44.58,42.96 45.61,41.93 IC6.12
N$43
  Top 0.305: IC5.2 48.35,31.99 50.75,31.99 IC5.1 51.09,31.65 52.12,30.62 52.12,16.56 R9.1
N$44
  Top 0.305: R9.2 52.12,8.67 52.12,1.47 OUT9.1
N$45
  Top 0.305: IC5.7 35.66,31.99 38.06,31.99 IC5.6
  Bottom 0.305: IC5.7 36.69,30.62 36.69,21.36 37.72,20.33 44.92,20.33 48.69,16.56 49.38,16.56 R10.1
N$46
  Top 0.305: R10.2 49.72,8.67 49.72,1.47 OUT10.1
N$47
  Bottom 0.305: IC7.9 65.84,57.37 64.12,59.08 64.12,68 64.81,68.68 81.27,68.68 82.3,69.71 IC10.14
N$48  (via drill 0.33)
  Top 0.305: v63.78,72.11 58.64,72.11 IC7.2 | v69.61,71.08 72.35,68.34 72.35,48.45 69.61,45.71 v66.18,45.71
  Bottom 0.305: v63.78,72.11 64.81,71.08 v69.61,71.08 | v66.18,45.71 66.18,41.93 IC8.10
N$49
  Top 0.305: IC5.9 38.06,24.11 35.66,24.11 IC5.8
  Bottom 0.305: R11.1 46.98,16.56 46.29,16.56 43.2,19.65 37.38,19.65 35.66,21.36 35.66,24.11 IC5.8
N$50
  Top 0.305: R12.1 44.58,16.56 44.58,19.65 48.01,23.08 48.01,24.11 IC5.13 48.35,24.11 50.75,24.11 IC5.14
N$51
  Top 0.305: R13.1 42.18,16.56 42.18,18.28 46.98,23.08 46.98,47.42 48.01,48.45 48.01,49.48 IC6.2 48.35,49.82 50.75,49.82 IC6.1
N$52
  Bottom 0.305: IC6.6 38.06,49.82 35.66,49.82 IC6.7 35.32,49.48 33.6,47.76 33.6,21.36 35.66,19.3 35.66,15.88 36.35,15.19 37.38,15.19 38.41,16.22 39.09,16.22 R14.1
N$53
  Top 0.305: IC6.8 35.66,41.93 38.06,41.93 IC6.9
  Bottom 0.305: R15.1 36.69,16.56 36.69,19.3 34.29,21.7 34.29,40.56 35.32,41.59 IC6.8
N$54
  Top 0.305: R16.1 34.29,16.22 35.32,16.22 36.35,15.19 52.46,15.19 53.49,16.22 53.49,39.19 51.09,41.59 IC6.14 50.75,41.93 48.35,41.93 IC6.13
N$55
  Top 0.305: R11.2 46.98,8.67 46.98,1.47 OUT11.1
N$56
  Top 0.305: R12.2 44.58,8.67 44.58,1.47 OUT12.1
N$57
  Top 0.305: R13.2 42.18,8.67 42.18,1.47 OUT13.1
N$58
  Top 0.305: R14.2 39.43,8.67 39.43,1.47 OUT14.1
N$59
  Top 0.305: R15.2 37.03,8.67 37.03,1.47 OUT15.1
N$60
  Top 0.305: OUT16.1 R16.2
N$61  (via drill 0.33)
  Top 0.305: v61.38,52.56 v61.38,55.65 | v59.32,49.48 59.32,48.79 63.44,44.68 68.24,44.68 70.98,41.93 IC8.12
  Bottom 0.305: v61.38,55.65 61.38,61.14 61.72,61.48 61.72,68 60.01,69.71 58.64,69.71 IC7.3 | v61.38,52.56 59.32,50.51 v59.32,49.48
N$62
  Top 0.305: IC7.4 58.64,67.31 60.35,65.59 60.35,51.88 58.29,49.82 58.29,48.79 63.09,43.99 63.78,43.99 64.81,42.96 64.81,39.88 70.98,33.71 70.98,31.99 IC9.3
N$63
  Top 0.305: IC7.5 58.29,64.57 55.89,62.17 55.89,43.65 65.84,33.71 65.84,31.99 IC9.5
N$64  (via drill 0.33)
  Top 0.305: v54.86,58.74 54.86,35.42 65.84,24.45 IC9.10
  Bottom 0.305: v54.86,58.74 58.29,62.17 IC7.6
N$65
  Top 0.305: IC7.15 66.18,72.11 67.21,72.11 70.98,68.34 70.98,49.82 IC8.3
N$66  (via drill 0.33)
  Top 0.305: v60.69,67.65 60.69,66.28 61.38,65.59 61.38,59.42 66.52,54.28 68.24,54.28 69.95,52.56 69.95,48.45 68.92,47.42 68.24,47.42 66.18,49.48 IC8.5
  Bottom 0.305: v60.69,67.65 59.66,68.68 56.24,68.68 55.21,69.71 55.21,72.45 57.61,74.85 58.29,74.85 IC7.1
N$67
  Top 0.305: IC7.7 58.29,59.42 56.58,57.71 56.58,43.99 67.21,33.36 67.21,28.22 70.98,24.45 IC9.12
N$68
  Top 0.305: IC8.2 73.72,49.82 76.12,49.82 IC8.1 76.47,49.48 77.5,48.45 77.5,16.56 R17.1
N$69
  Top 0.305: R17.2 77.5,8.67 77.5,1.47 OUT17.1
N$70
  Top 0.305: IC8.7 61.04,49.82 63.44,49.82 IC8.6
  Bottom 0.305: R18.1 74.75,16.22 72.35,13.82 60.69,13.82 58.29,16.22 58.29,47.08 60.69,49.48 IC8.7
N$71
  Top 0.305: R18.2 75.09,8.67 75.09,1.47 OUT18.1
N$72
  Top 0.305: IC8.8 61.04,41.93 63.44,41.93 IC8.9
  Bottom 0.305: R19.1 72.35,16.22 71.32,16.22 70.29,15.19 64.47,15.19 63.44,16.22 63.44,18.28 58.98,22.73 58.98,39.88 60.69,41.59 IC8.8
N$73
  Top 0.305: R20.1 69.95,16.56 69.95,20.33 72.35,22.73 72.35,40.56 73.38,41.59 IC8.13 73.72,41.93 76.12,41.93 IC8.14
N$74
  Top 0.305: IC9.1 76.12,31.99 73.72,31.99 IC9.2
  Bottom 0.305: R21.1 67.21,16.56 67.21,25.48 73.38,31.65 IC9.2
N$75
  Top 0.305: IC9.7 61.04,31.99 63.44,31.99 IC9.6
  Bottom 0.305: R22.1 64.47,16.56 64.47,18.28 59.66,23.08 59.66,30.62 60.69,31.65 IC9.7
N$76
  Top 0.305: 62.06,24.11 63.44,24.11 IC9.9 | 62.06,24.11 61.04,24.11 IC9.8 | 62.06,24.11 62.06,16.56 R23.1
N$77
  Top 0.305: IC9.14 76.12,24.11 73.72,24.11 IC9.13
  Bottom 0.305: R24.1 60.01,16.22 60.69,16.22 62.41,14.5 72.01,14.5 73.72,16.22 73.72,24.11 IC9.13
N$78
  Top 0.305: R19.2 72.69,8.67 72.69,1.47 OUT19.1
N$79
  Top 0.305: R20.2 69.95,8.67 69.95,1.47 OUT20.1
N$80
  Top 0.305: R21.2 67.55,8.67 67.55,1.47 OUT21.1
N$81
  Top 0.305: R22.2 64.81,8.67 64.81,1.47 OUT22.1
N$82
  Top 0.305: R23.2 62.41,8.67 62.41,1.47 OUT23.1
N$83
  Top 0.305: R24.2 60.01,8.67 60.01,1.47 OUT24.1
N$84
  Top 0.305: IC10.9 82.64,57.37 93.95,68.68 93.95,75.88 DOUT.1
N$85
  Bottom 0.305: IC10.2 75.09,72.11 80.24,72.11 81.27,71.08 83.67,71.08 90.18,64.57 90.18,42.96 89.15,41.93 IC11.10
N$86  (via drill 0.33)
  Top 0.305: v95.33,65.94 95.33,48.45 94.3,47.42 94.3,41.93 IC11.12
  Bottom 0.305: v95.33,65.94 84.35,76.91 72.69,76.91 72.01,76.23 72.01,72.8 74.75,70.05 IC10.3
N$87  (via drill 0.33)
  Top 0.305: v73.04,75.88 73.04,69.02 74.75,67.31 IC10.4
  Bottom 0.305: v73.04,75.88 73.38,76.23 83.67,76.23 95.33,64.57 95.33,40.91 94.3,39.88 94.3,31.99 IC12.3
N$88
  Top 0.305: IC10.5 75.09,64.57 77.84,61.82 77.84,51.54 82.64,46.74 82.64,40.56 86.41,36.79 86.75,36.79 88.81,34.73 88.81,31.99 IC12.5
N$89  (via drill 0.33)
  Top 0.305: v76.81,53.59 76.81,60.45 75.09,62.17 IC10.6
  Bottom 0.305: v76.81,53.59 79.21,53.59 82.64,50.16 82.64,27.88 85.04,25.48 85.04,21.02 85.72,20.33 86.75,20.33 88.81,22.39 88.81,24.11 IC12.10
N$90
  Bottom 0.305: IC10.15 82.64,72.11 83.67,72.11 93.95,61.82 93.95,49.82 IC11.3
N$91
  Top 0.305: IC10.1 75.09,74.85 78.52,71.42 78.52,58.74 83.33,53.94 91.21,53.94 92.58,52.56 92.58,48.11 91.9,47.42 91.21,47.42 89.15,49.48 IC11.5
N$92  (via drill 0.33)
  Top 0.305: v88.81,29.59 88.47,29.59 87.78,30.28 87.78,34.73 86.41,36.11 86.07,36.11 78.18,43.99 78.18,50.16 73.04,55.31 73.04,57.71 74.75,59.42 IC10.7
  Bottom 0.305: v88.81,29.59 93.95,24.45 IC12.12
N$93
  Top 0.305: IC11.2 96.7,49.82 98.75,49.82 IC11.1
  Bottom 0.305: R25.1 100.47,16.56 100.47,48.11 99.1,49.48 IC11.1
N$94
  Top 0.305: R25.2 100.47,8.67 100.47,1.47 OUT25.1
N$95
  Top 0.305: IC11.7 84.01,49.82 86.07,49.82 IC11.6 92.58,43.31 92.58,40.91 100.47,33.02 100.47,23.08 98.07,20.68 98.07,16.56 R26.1
N$96
  Top 0.305: R26.2 98.07,8.67 98.07,1.47 OUT26.1
N$97
  Top 0.305: IC11.8 84.01,41.93 86.07,41.93 IC11.9 86.41,41.59 90.18,37.82 90.18,23.08 88.81,21.7 88.81,16.22 89.84,15.19 93.27,15.19 94.3,16.22 94.98,16.22 R27.1
N$98
  Bottom 0.305: 97.73,40.56 97.73,22.73 92.93,17.93 92.93,16.56 R28.1 | 97.73,40.56 96.7,41.59 IC11.13 | 97.73,40.56 98.75,41.59 IC11.14
N$99
  Top 0.305: R29.1 90.18,16.56 90.18,17.93 95.33,23.08 95.33,30.62 96.36,31.65 IC12.2 96.7,31.99 98.75,31.99 IC12.1
N$100
  Top 0.305: IC12.7 84.01,31.99 86.07,31.99 IC12.6 86.41,31.65 86.41,30.62 87.78,29.25 87.78,16.56 R30.1
N$101
  Top 0.305: 85.04,24.11 86.07,24.11 IC12.9 | 85.04,24.11 84.01,24.11 IC12.8 | 85.04,24.11 85.04,16.56 R31.1
N$102
  Top 0.305: IC12.14 98.75,24.11 96.7,24.11 IC12.13
  Bottom 0.305: R32.1 82.64,16.56 83.33,16.56 85.72,18.96 91.21,18.96 96.36,24.11 IC12.13
N$103
  Top 0.305: R27.2 95.33,8.67 95.33,1.47 OUT27.1
N$104
  Top 0.305: R28.2 92.93,8.67 92.93,1.47 OUT28.1
N$105
  Top 0.305: R29.2 90.18,8.67 90.18,1.47 OUT29.1
N$106
  Top 0.305: R30.2 87.78,8.67 87.78,1.47 OUT30.1
N$107
  Top 0.305: R31.2 85.38,8.67 85.38,1.47 OUT31.1
N$108
  Top 0.305: R32.2 82.64,8.67 82.64,1.47 OUT32.1

### Text on the board
tPlace: PGTNX05 | GATE OUT | Robert Ellis 2019